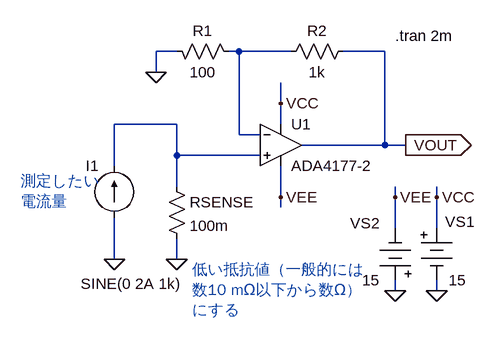
[diagram p0: schematic fig-01-02-22.asc]
fig-01-02-22.asc, the LTspice schematic file:
Version 4
SHEET 1 880 680
WIRE 48 32 16 32
WIRE 144 32 128 32
WIRE 224 32 144 32
WIRE 368 32 304 32
WIRE 16 64 16 32
WIRE 208 112 208 80
WIRE 48 144 -48 144
WIRE 208 144 208 112
WIRE 144 160 144 32
WIRE 176 160 144 160
WIRE 368 176 368 32
WIRE 368 176 240 176
WIRE 400 176 368 176
WIRE 48 192 48 144
WIRE 176 192 48 192
WIRE -48 208 -48 144
WIRE 48 240 48 192
WIRE 208 256 208 208
WIRE 384 256 384 240
WIRE 448 256 448 240
WIRE 208 272 208 256
WIRE 384 304 384 256
WIRE 448 304 448 256
WIRE -48 352 -48 288
WIRE 48 352 48 320
WIRE 384 400 384 384
WIRE 448 400 448 384
FLAG 48 352 0
FLAG -48 352 0
FLAG 400 176 VOUT
IOPIN 400 176 Out
FLAG 384 400 0
FLAG 448 400 0
FLAG 384 256 VEE
FLAG 448 256 VCC
FLAG 208 112 VCC
FLAG 208 256 VEE
FLAG 16 64 0
SYMBOL res 320 16 R90
WINDOW 0 0 56 VBottom 2
WINDOW 3 32 56 VTop 2
SYMATTR InstName R2
SYMATTR Value 1k
SYMBOL current -48 288 R180
WINDOW 0 24 80 Left 2
WINDOW 3 -102 -101 Left 2
WINDOW 123 0 0 Left 0
WINDOW 39 0 0 Left 0
SYMATTR InstName I1
SYMATTR Value SINE(0 2A 1k)
SYMBOL Misc\\battery 448 288 R0
WINDOW 0 13 6 Left 2
WINDOW 3 18 96 Left 2
SYMATTR InstName VS1
SYMATTR Value 15
SYMBOL Misc\\battery 384 400 R180
WINDOW 0 24 104 Left 2
WINDOW 3 24 16 Left 2
SYMATTR InstName VS2
SYMATTR Value 15
SYMBOL res 32 16 M90
WINDOW 0 0 56 VBottom 2
WINDOW 3 32 56 VTop 2
SYMATTR InstName R1
SYMATTR Value 100
SYMBOL res 32 224 R0
SYMATTR InstName RSENSE
SYMATTR Value 100m
SYMBOL Opamps\\ADA4177-2 208 176 R0
SYMATTR InstName U1
TEXT 384 8 Left 2 !.tran 2m
TEXT 72 368 Left 2 ;低い抵抗値（一般的には\n数10 mΩ以下から数Ω）\nにする
TEXT -192 232 Left 2 ;測定したい\n電流量

The netlist it stands for:
* fig-01-02-22.asc
R2 VOUT N001 1k
I1 0 N002 SINE(0 2A 1k)
VS1 VCC 0 15
VS2 0 VEE 15
R1 0 N001 100
RSENSE N002 0 100m
* U1: ADA4177-2 (symbol Opamps\ADA4177-2 not available, pins judged from their places): In+=N002 In-=N001 V+=VCC V-=VEE OUT=VOUT
.tran 2m
* 低い抵抗値（一般的には
* 数10 mΩ以下から数Ω）
* にする
* 測定したい
* 電流量
.backanno
.end